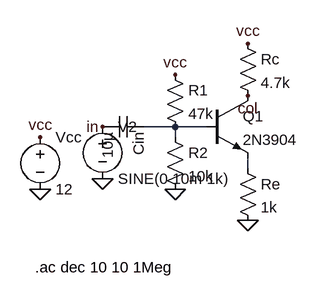
[diagram p0: schematic ce_amp.asc]
ce_amp.asc, the LTspice schematic file:
Version 4
SHEET 1 1600 1000
WIRE 16 64 16 80
WIRE -32 64 16 64
WIRE 16 64 64 64
WIRE 128 112 128 128
FLAG -192 80 vcc
FLAG -192 160 0
FLAG 16 -16 vcc
FLAG 16 160 0
FLAG 128 -64 vcc
FLAG 128 16 col
FLAG 128 208 0
FLAG -96 144 0
FLAG -96 64 in
SYMBOL voltage -192 64 R0
SYMATTR InstName Vcc
SYMATTR Value 12
SYMBOL voltage -96 48 R0
SYMATTR InstName V2
SYMATTR Value SINE(0 10m 1k)
SYMATTR Value2 AC 1
SYMBOL cap -32 48 R90
SYMATTR InstName Cin
SYMATTR Value 10µ
SYMBOL res 0 -32 R0
SYMATTR InstName R1
SYMATTR Value 47k
SYMBOL res 0 64 R0
SYMATTR InstName R2
SYMATTR Value 10k
SYMBOL npn 64 16 R0
SYMATTR InstName Q1
SYMATTR Value 2N3904
SYMBOL res 112 -80 R0
SYMATTR InstName Rc
SYMATTR Value 4.7k
SYMBOL res 112 112 R0
SYMATTR InstName Re
SYMATTR Value 1k
TEXT -200 280 Left 2 !.ac dec 10 10 1Meg

The netlist it stands for:
* ce_amp.asc
Vcc vcc 0 12
V2 in 0 SINE(0 10m 1k) AC 1
Cin N001 in 10µ
R1 vcc N001 47k
R2 N001 0 10k
Q1 col N001 N002 0 2N3904
Rc vcc col 4.7k
Re N002 0 1k
.model NPN NPN
.model PNP PNP
.lib standard.bjt
.ac dec 10 10 1Meg
.backanno
.end